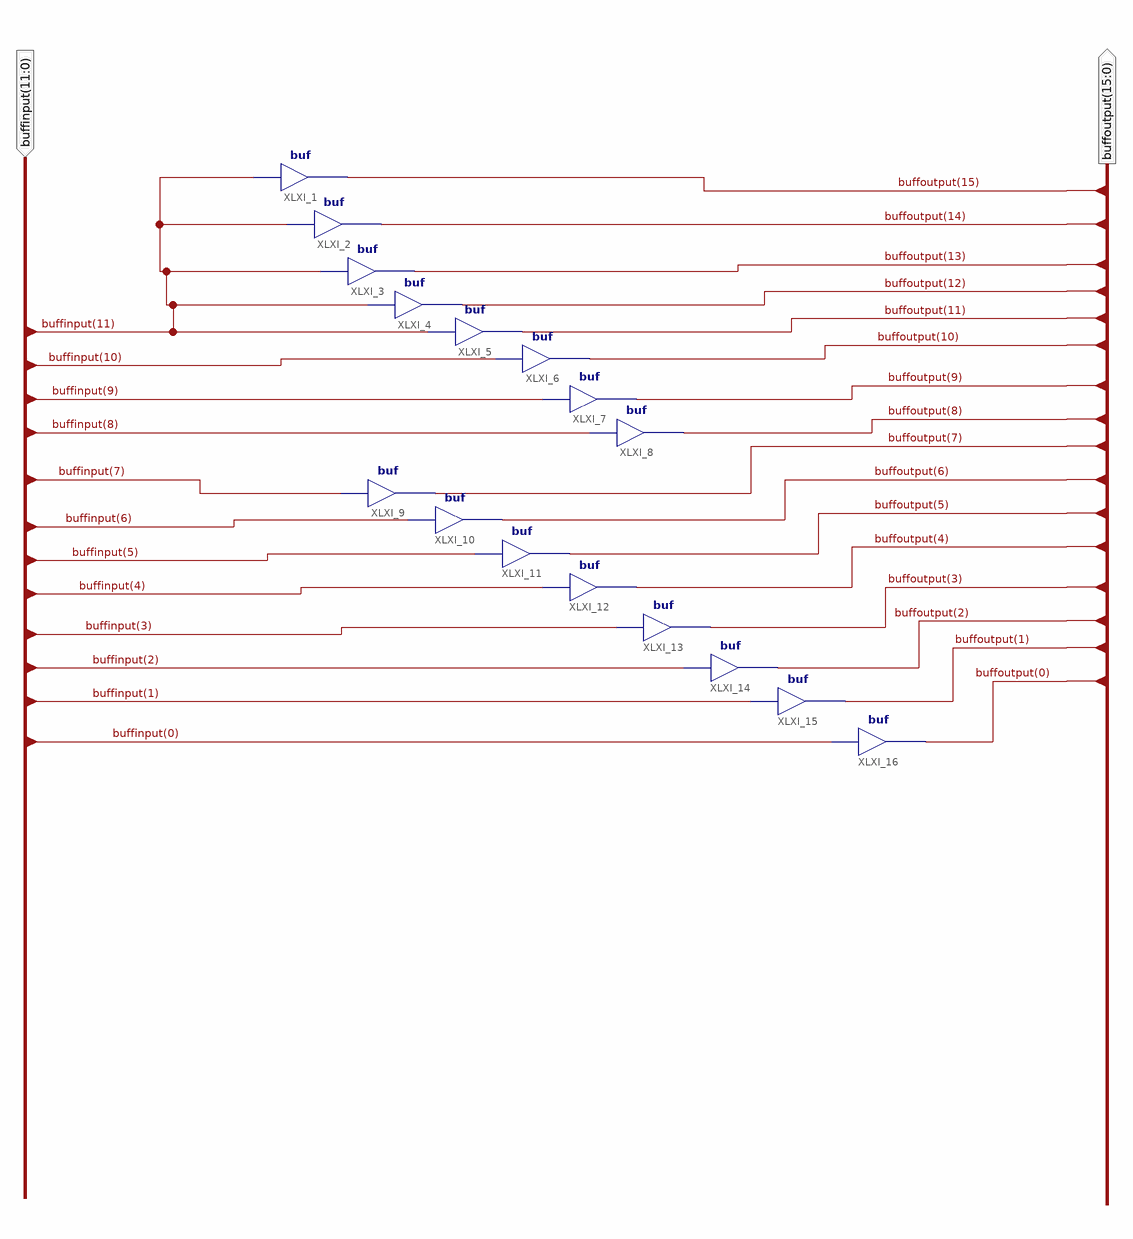
[diagram p0: schematic sheet 1]
// Xilinx ISE schematic bit16buffermodified.sch (spartan3) as structural Verilog: 16 symbols, 2 ports
module bit16buffermodified (
  input  [11:0] buffinput,
  output [15:0] buffoutput
);

  buf XLXI_1 (buffoutput[15], buffinput[11]);
  buf XLXI_2 (buffoutput[14], buffinput[11]);
  buf XLXI_3 (buffoutput[13], buffinput[11]);
  buf XLXI_4 (buffoutput[12], buffinput[11]);
  buf XLXI_5 (buffoutput[11], buffinput[11]);
  buf XLXI_6 (buffoutput[10], buffinput[10]);
  buf XLXI_7 (buffoutput[9], buffinput[9]);
  buf XLXI_8 (buffoutput[8], buffinput[8]);
  buf XLXI_9 (buffoutput[7], buffinput[7]);
  buf XLXI_10 (buffoutput[6], buffinput[6]);
  buf XLXI_11 (buffoutput[5], buffinput[5]);
  buf XLXI_12 (buffoutput[4], buffinput[4]);
  buf XLXI_13 (buffoutput[3], buffinput[3]);
  buf XLXI_14 (buffoutput[2], buffinput[2]);
  buf XLXI_15 (buffoutput[1], buffinput[1]);
  buf XLXI_16 (buffoutput[0], buffinput[0]);
endmodule
